# EAGLE design tjunction (EAGLE 5.11)
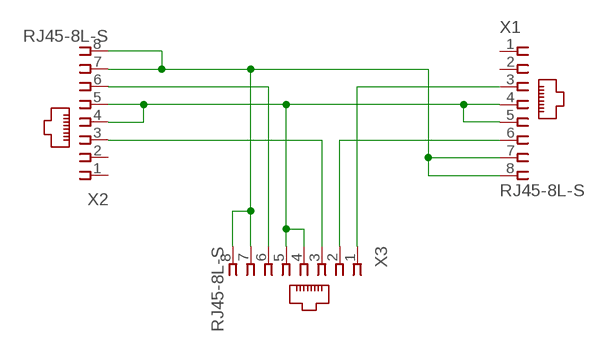
[diagram p0: schematic, sheet 1]

## Parts
X1  RJ45-8L-S  [RJ45-NO-SHIELD]
X2  RJ45-8L-S  [RJ45-NO-SHIELD]
X3  RJ45-8L-S  [RJ45-NO-SHIELD]

## Nets
N$1: X1.3 X3.1
N$2: X1.6 X3.2
N$5: X1.7 X1.8 X2.7 X2.8 X3.7 X3.8
N$6: X2.3 X3.3
N$7: X2.6 X3.6
N$10: X1.4 X1.5 X2.4 X2.5 X3.4 X3.5
Unconnected: X1.1 X1.2 X2.1 X2.2

## Library data of the parts
X1-X3 = con-tycoelectronics:RJ45: CORCOM Modular RJ Jacks No Shield Source: www.tycoelectronics.com .. ENG_DS_1654001_1099_RJ_L_0507.pdf; MF: TYCO ELECTRONICS; MPN: RJ45-8L-S; OC_FARNELL: unknown; OC_NEWARK: 80K9067

## Board
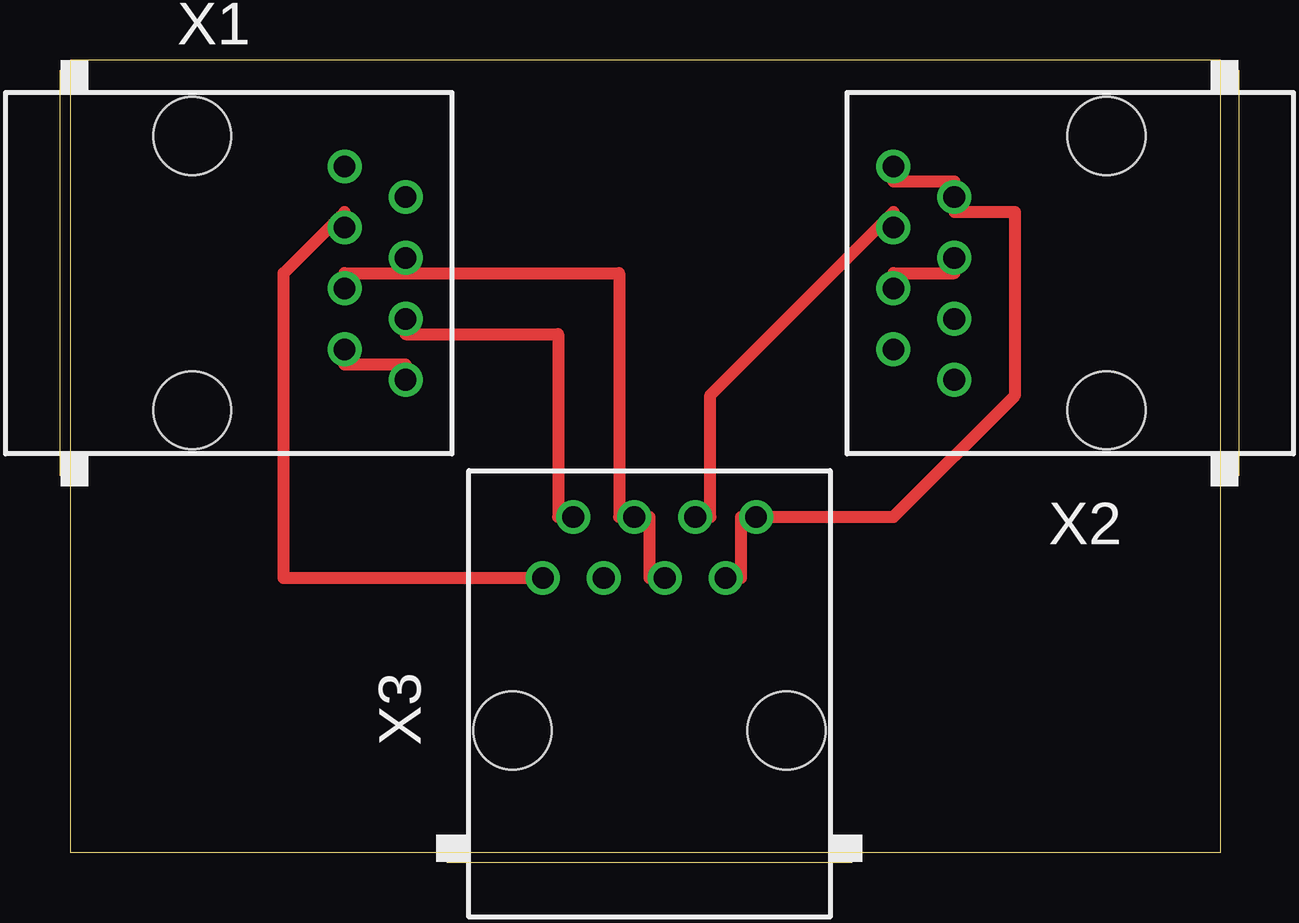
[diagram p1: board, top side]
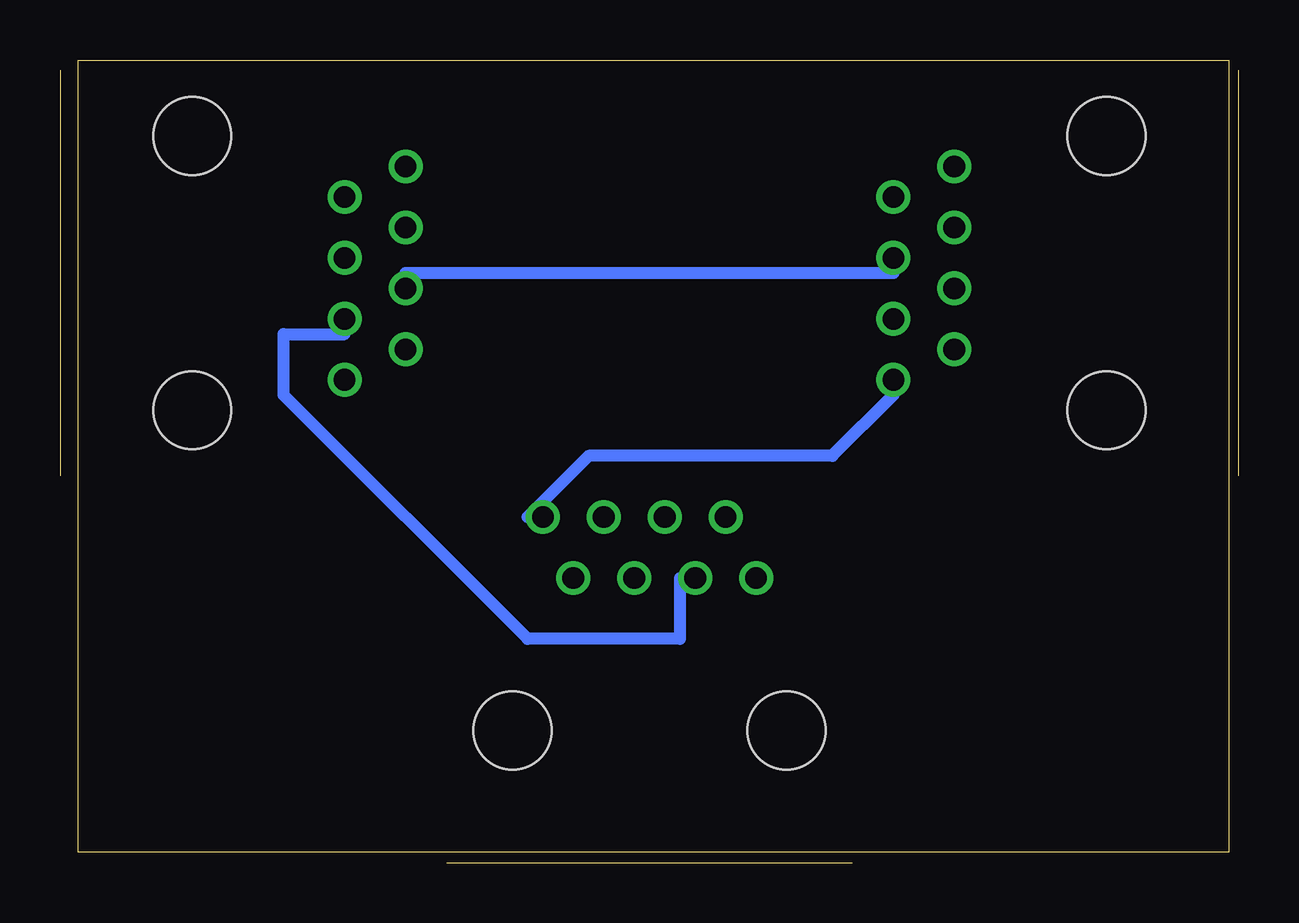
[diagram p2: board, bottom side, seen from below]

Size 47.93 x 33.01 mm. Coordinates in mm from the lower left corner, seen from the top.
Outline: 0,0 47.93,0 47.93,33.01 0,33.01 0,0
Copper layers (1*16): Top 0.035mm / dielectric 1.5mm / Bottom 0.035mm
Design rules "default *": minimum track width 20mil, minimum drill 24mil, track to track 20mil, track to pad 20mil, pad to pad 20mil, via to via 20mil, smd to smd 8mil, copper to edge 40mil, drill to drill 8mil, minimum pad ring 10mil, minimum via ring 8mil, stop-mask expansion 4mil, vias tented up to drill 0mil, thermal gap 10mil

### Footprints (pad centres in the part's own frame; a part is rotated, then mirrored left to right if it is on the bottom)
RJ45-NO-SHIELD = drill 0.9 pad 1.4 round: 1 -4.445,6.35; 2 -3.175,8.89; 3 -1.905,6.35; 4 -0.635,8.89; 5 0.635,6.35; 6 1.905,8.89; 7 3.175,6.35; 8 4.445,8.89 | hole 3.251: -5.715,0; 5.715,0

### Placement (x,y rotation side)
X1  5.08,24.13 270 top
X2  43.18,24.13 90 top
X3  24.13,5.08 0 top

### Tracks (layer width: path | path; a pad name or v marks a point on that pad's centre or on a via)
N$1
  Top 0.508: X3.1 8.89,11.43 8.89,24.13 11.43,26.67 X1.3
N$2
  Top 0.508: X1.6 13.97,21.59 20.32,21.59 20.32,13.97 X3.2
N$5
  Top 0.508: X2.8 34.29,27.94 36.83,27.94 X2.7 36.83,26.67 39.37,26.67 39.37,19.05 34.29,13.97 X3.8 27.94,13.97 27.94,11.43 X3.7 | X1.8 13.97,20.32 11.43,20.32 X1.7
  Bottom 0.508: X1.8 13.97,19.05 16.51,16.51 26.67,16.51 29.21,13.97 X3.8
N$6
  Bottom 0.508: X3.3 22.86,11.43 22.86,8.89 29.21,8.89 39.37,19.05 39.37,21.59 36.83,21.59 X2.3
N$7
  Top 0.508: X3.6 26.67,13.97 26.67,19.05 34.29,26.67 X2.6
N$10
  Top 0.508: X2.4 34.29,24.13 36.83,24.13 X2.5 | 13.97,24.13 11.43,24.13 X1.5 | X3.5 24.13,11.43 24.13,13.97 X3.4 22.86,13.97 22.86,24.13 13.97,24.13 | 13.97,24.13 X1.4
  Bottom 0.508: X2.4 34.29,24.13 13.97,24.13 X1.4